# EAGLE design TEST_BED_BATT_BUTTONS (EAGLE 9.6.2)
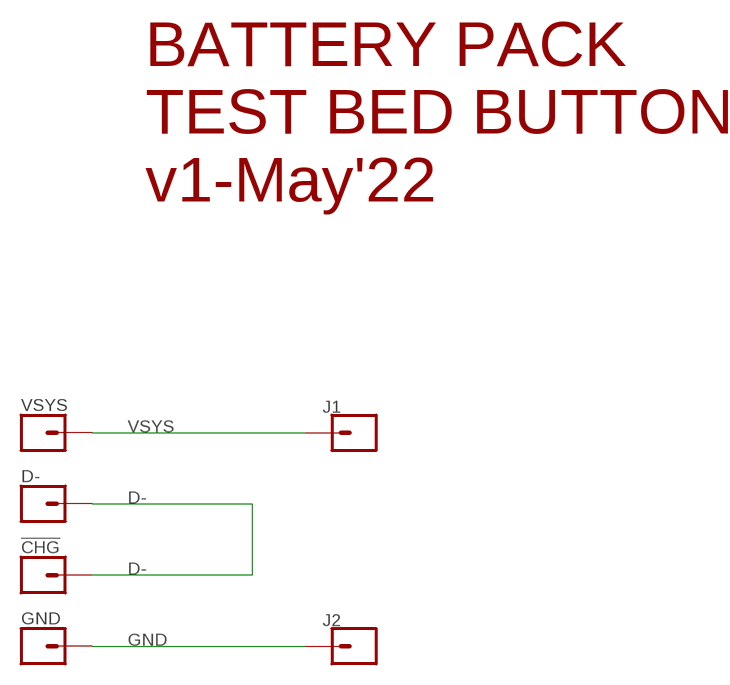
[diagram p0: schematic, sheet 1]

## Parts
!CHG  CONN_01POGOPIN_HOLE_LARGE  [1X01_POGOPIN_HOLE_0.061_DIA]
D-  CONN_01POGOPIN_HOLE_LARGE  [1X01_POGOPIN_HOLE_0.061_DIA]
GND  CONN_01POGOPIN_HOLE_LARGE  [1X01_POGOPIN_HOLE_0.061_DIA]
J1  CONN_01PTH_2MM  [1X01_2MM]
J2  CONN_01PTH_2MM  [1X01_2MM]
VSYS  CONN_01POGOPIN_HOLE_LARGE  [1X01_POGOPIN_HOLE_0.061_DIA]

## Nets
D-: !CHG.2 D-.2
GND: GND.2 J2.1
VSYS: J1.1 VSYS.2

## Notes on the sheet
- BATTERY PACK
  TEST BED BUTTONS
  v1-May'22

## Library data of the parts
!CHG D- GND J1 J2 VSYS = SparkFun-Connectors:CONN_01: Single connection point. Often used as Generic Header-pin footprint for 0.1 inch spaced/style header connections On any of the 0.1 inch spaced packages, you can populate with these: Break Away Headers - Straight <https://www.sparkfun.com/products/116> (PRT-00116) Break Away Male Headers - Right Angle <https://www.sparkfun.com/products/553> (PRT-00553) Female Headers <https://www.sparkfun.com/products/115> (PRT-00115) Break Away Headers - Machine Pin <https://www.sparkfun.com/products/117> (PRT-00117) Break Away Female Headers - Swiss Machine Pin <https://www.sparkfun.com/products/743> (PRT-00743) This device is also useful as a general connection point to wire up your design to another part of your project. Our various solder wires solder well into these plated through hole pads. Hook-Up Wire - Assortment (Stranded, 22 AWG) <https://www.sparkfun.com/products/11375> (PRT-11375) Hook-Up Wire - Assortment (Solid Core, 22 AWG) <https://www.sparkfun.com/products/11367> (PRT-11367) View the entire wire category on our website here <https://www.sparkfun.com/categories/141> Special notes: SMTSO-256-ET is a "flush mount" nut for a 4-40 screw. We mostly use this on specialty testbeds; it is a nice way to connect hardware to your PCB at an adjustable hieght. Also note, the SNAP packages are for using a snappable style connector. We sell a baggie of snaps and they are also used on two LilyPad designs: Snap Assortment - 30 pack (male and female) <https://www.sparkfun.com/products/11347> (DEV-11347) LilyPad Arduino SimpleSnap <https://www.sparkfun.com/products/10941> (DEV-10941) LilyPad SimpleSnap Protoboard <https://www.sparkfun.com/products/10940> (DEV-10940)

## Net classes
1 power: width 0.178 mm
2 gnd: width 0.305 mm, drill 0.483 mm, clearance 0.203 mm

## Board
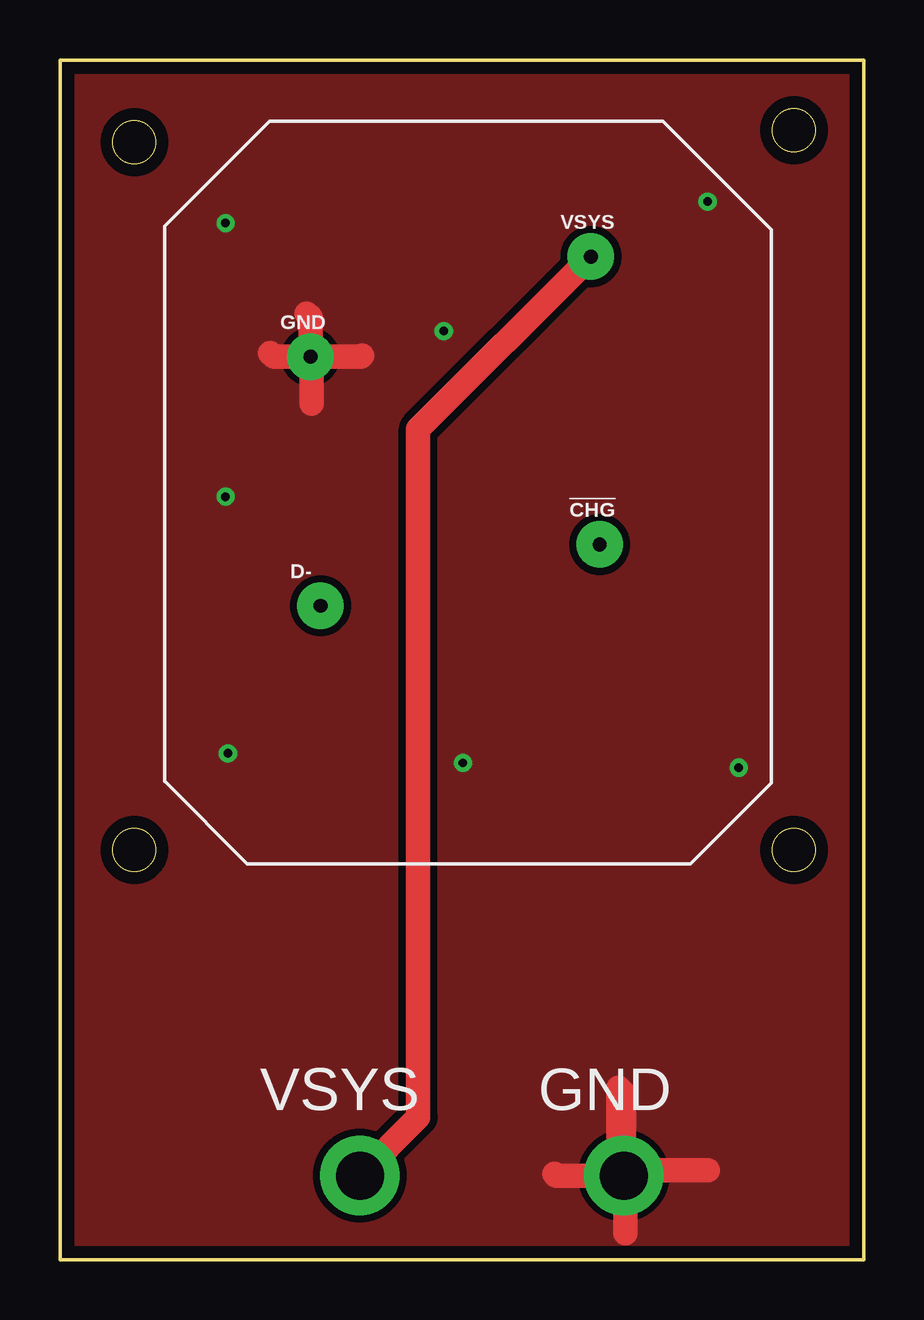
[diagram p1: board, top side]
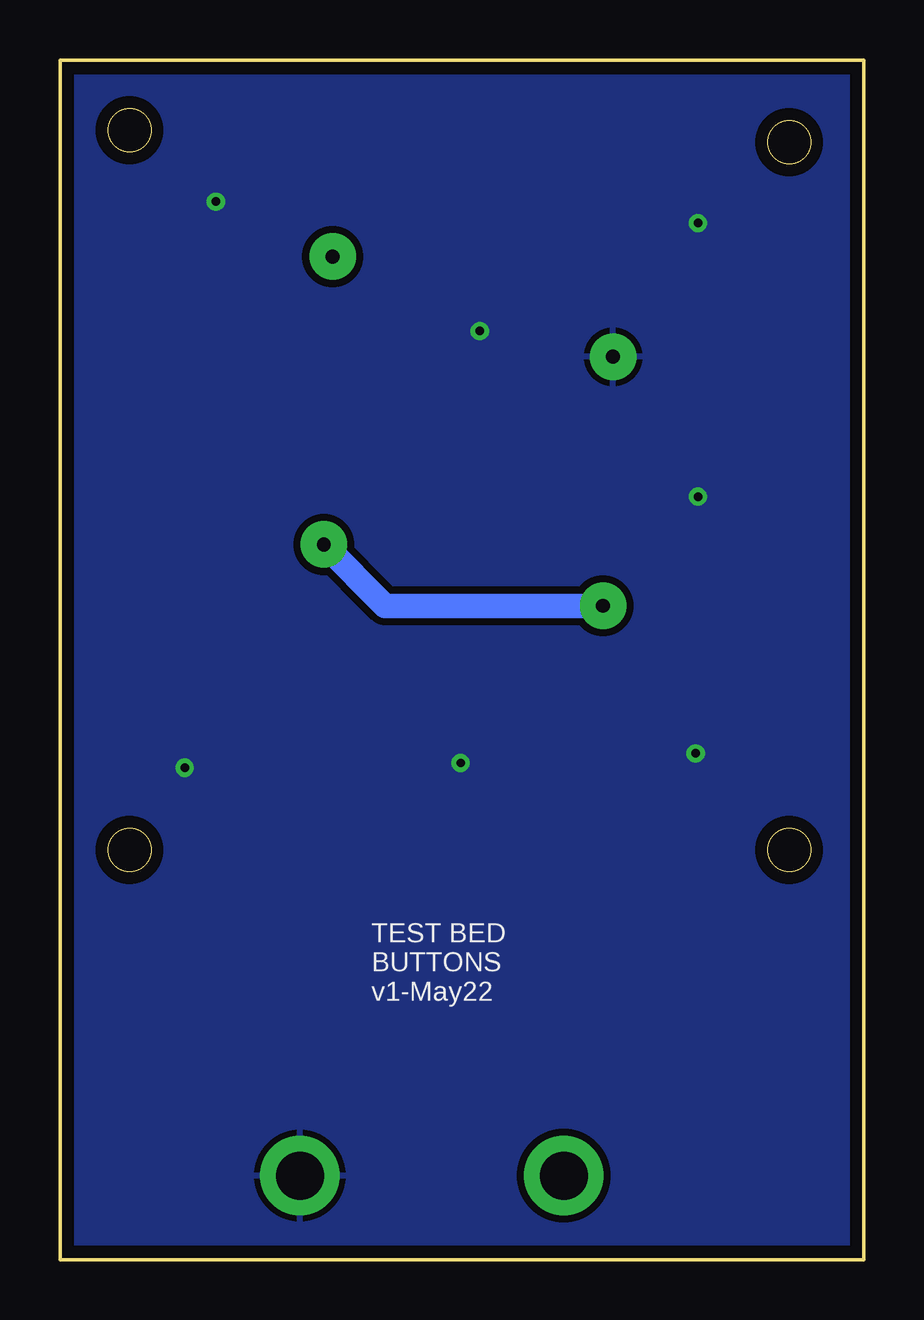
[diagram p2: board, bottom side, seen from below]

Size 33.5 x 50 mm. Coordinates in mm from the lower left corner, seen from the top.
Outline: 0,0 33.5,0 33.5,50 0,50 0,0
Outline: circle at 30.6,47.08 radius 0.9
Outline: circle at 30.6,17.08 radius 0.9
Outline: circle at 3.1,17.08 radius 0.9
Outline: circle at 3.1,46.58 radius 0.9
Copper layers (1*16): Top 0.035mm / dielectric 1.5mm / Bottom 0.035mm
Design rules "default *": minimum track width 6mil, minimum drill 0.3mm, track to track 10mil, track to pad 10mil, pad to pad 10mil, via to via 10mil, smd to smd 6mil, copper to edge 20mil, drill to drill 6mil, minimum pad ring 10mil, minimum via ring 8mil, stop-mask expansion 4mil, vias tented up to drill 50mil, thermal gap 10mil

### Footprints (pad centres in the part's own frame; a part is rotated, then mirrored left to right if it is on the bottom)
1X01_POGOPIN_HOLE_0.061_DIA = drill 0.58 pad 1.93: 2 0,0
1X01_2MM = drill 2 pad 3.302: 1 0,0

### Placement (x,y rotation side)
!CHG  22.5,29.81 0 top
D-  10.86,27.25 0 top
GND  10.44,37.63 0 top
J1  12.5,3.5 0 top
J2  23.5,3.5 0 top
VSYS  22.13,41.81 0 top

### Tracks (layer width: path | path; a pad name or v marks a point on that pad's centre or on a via)
D-
  Bottom 1.016: D-.2 19.94,27.25 !CHG.2
GND  (via drill 0.35)
  Top 1.016: J2.1 23.5,6.93 23.28,7.15 23.28,3.72 J2.1 | J2.1 23.72,3.72 27.01,3.72 | J2.1 23.58,3.42 23.58,1.09 | J2.1 20.69,3.5 20.61,3.58 | GND.2 12.55,37.63 12.6,37.68 | GND.2 10.44,39.28 10.29,39.43 | GND.2 10.49,37.58 10.49,35.67 | GND.2 8.92,37.63 8.77,37.78
  other vias: 6.9,43.2 7,21.1 16.8,20.7 28.3,20.5 6.9,31.8 16,38.7 27,44.1
  pour Top (isolate 0.305): -1.68,52.03 -1.68,-1.92 35.57,-1.92 35.57,52.03
  pour Bottom (isolate 0.305): 34.7,50.73 34.7,-0.82 -0.83,-0.82 -0.83,50.73
VSYS
  Top 1.016: J1.1 14.93,5.93 14.93,34.61 VSYS.2

### Text on the board
tNames: VSYS | GND
bNames: TEST BED / BUTTONS / v1-May22